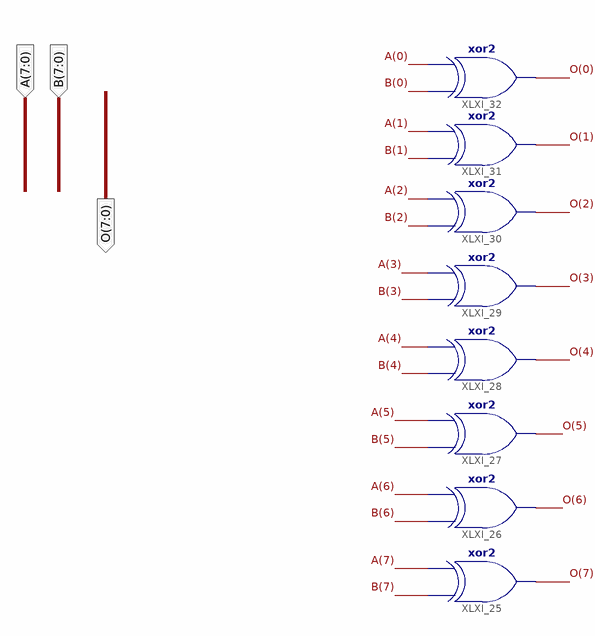
[diagram p0: schematic sheet 1]
// Xilinx ISE schematic XORBUS8.sch (spartan6) as structural Verilog: 8 symbols, 3 ports
module XORBUS8 (
  input  [7:0] A,
  input  [7:0] B,
  output [7:0] O
);

  xor XLXI_25 (O[7], B[7], A[7]);
  xor XLXI_26 (O[6], B[6], A[6]);
  xor XLXI_27 (O[5], B[5], A[5]);
  xor XLXI_28 (O[4], B[4], A[4]);
  xor XLXI_29 (O[3], B[3], A[3]);
  xor XLXI_30 (O[2], B[2], A[2]);
  xor XLXI_31 (O[1], B[1], A[1]);
  xor XLXI_32 (O[0], B[0], A[0]);
endmodule
